# Altium schematic sheet lasers.SchDoc
size Letter
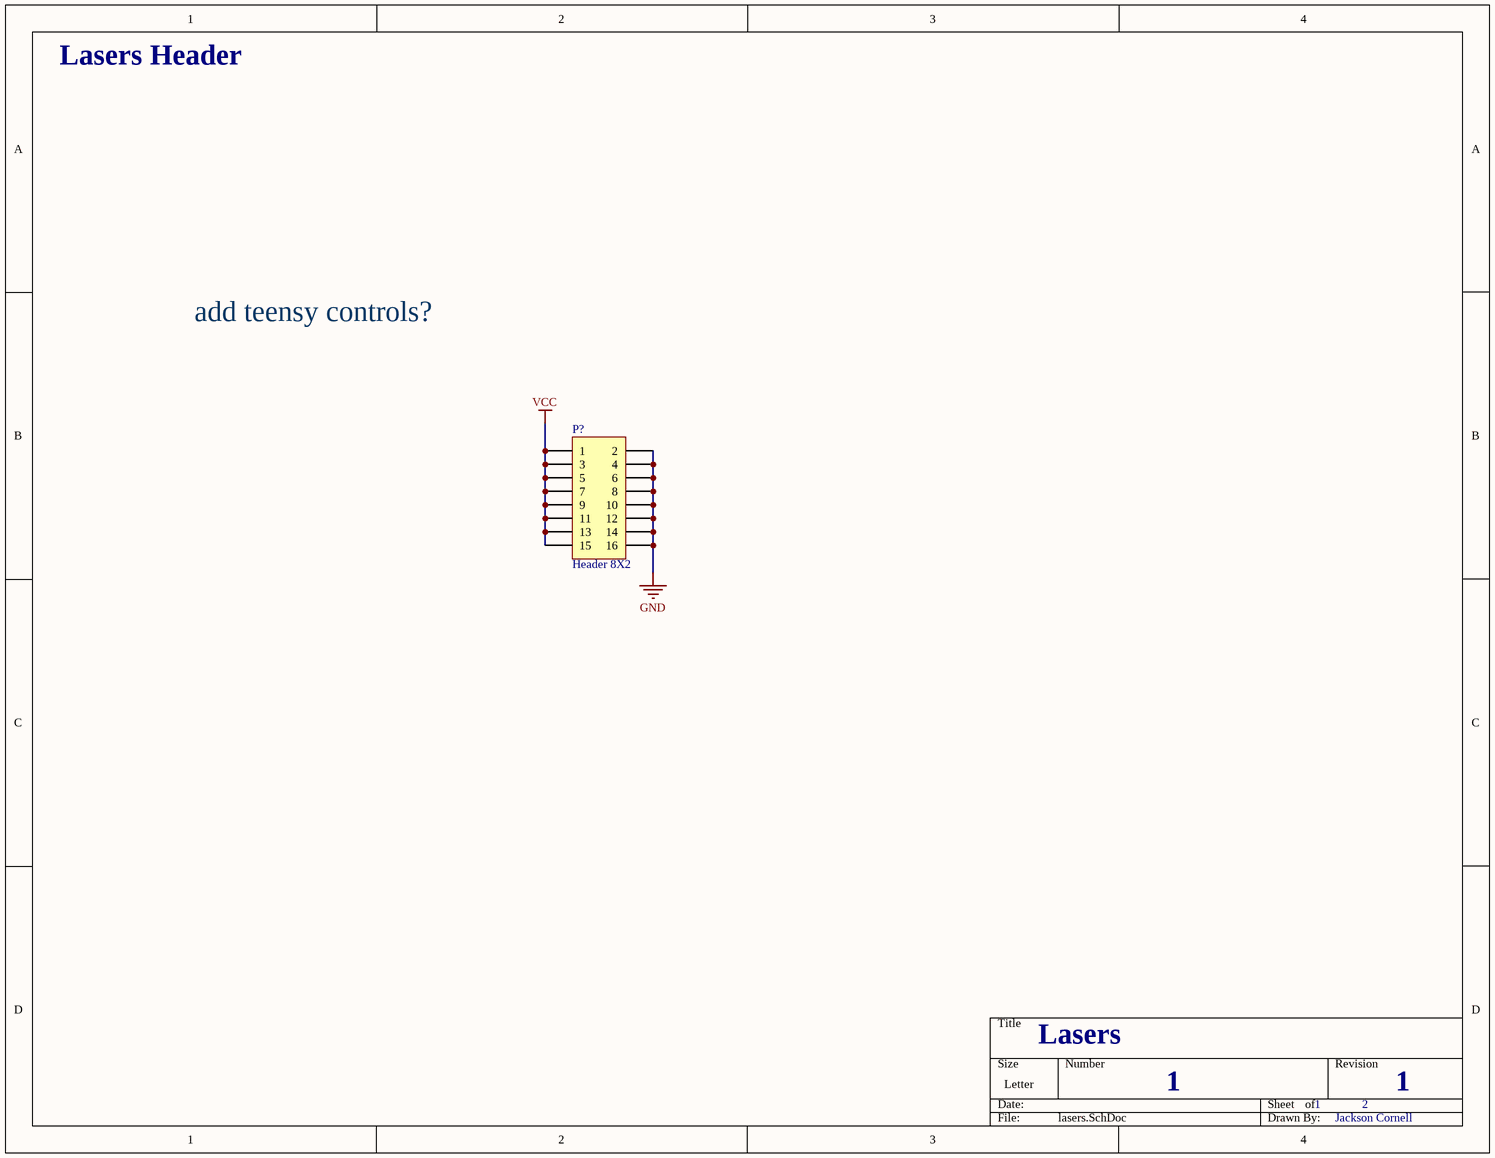
[diagram p0: lasers.SchDoc]

## Parts
P?  Header 8X2  [HDR2X8]

## Nets
GND: P?.2 P?.4 P?.6 P?.8 P?.10 P?.12 P?.14 P?.16
VCC: P?.1 P?.3 P?.5 P?.7 P?.9 P?.11 P?.13 P?.15

## Notes on the sheet
- Lasers Header
- add teensy controls?
- Lasers
- 1
- 2
- Jackson Cornell

## Library data of the parts
P? = Header 8X2: Header, 8-Pin, Dual row; LatestRevisionDate: 17-Jul-2002; LatestRevisionNote: Re-released for DXP Platform.; Publisher: Altium Limited